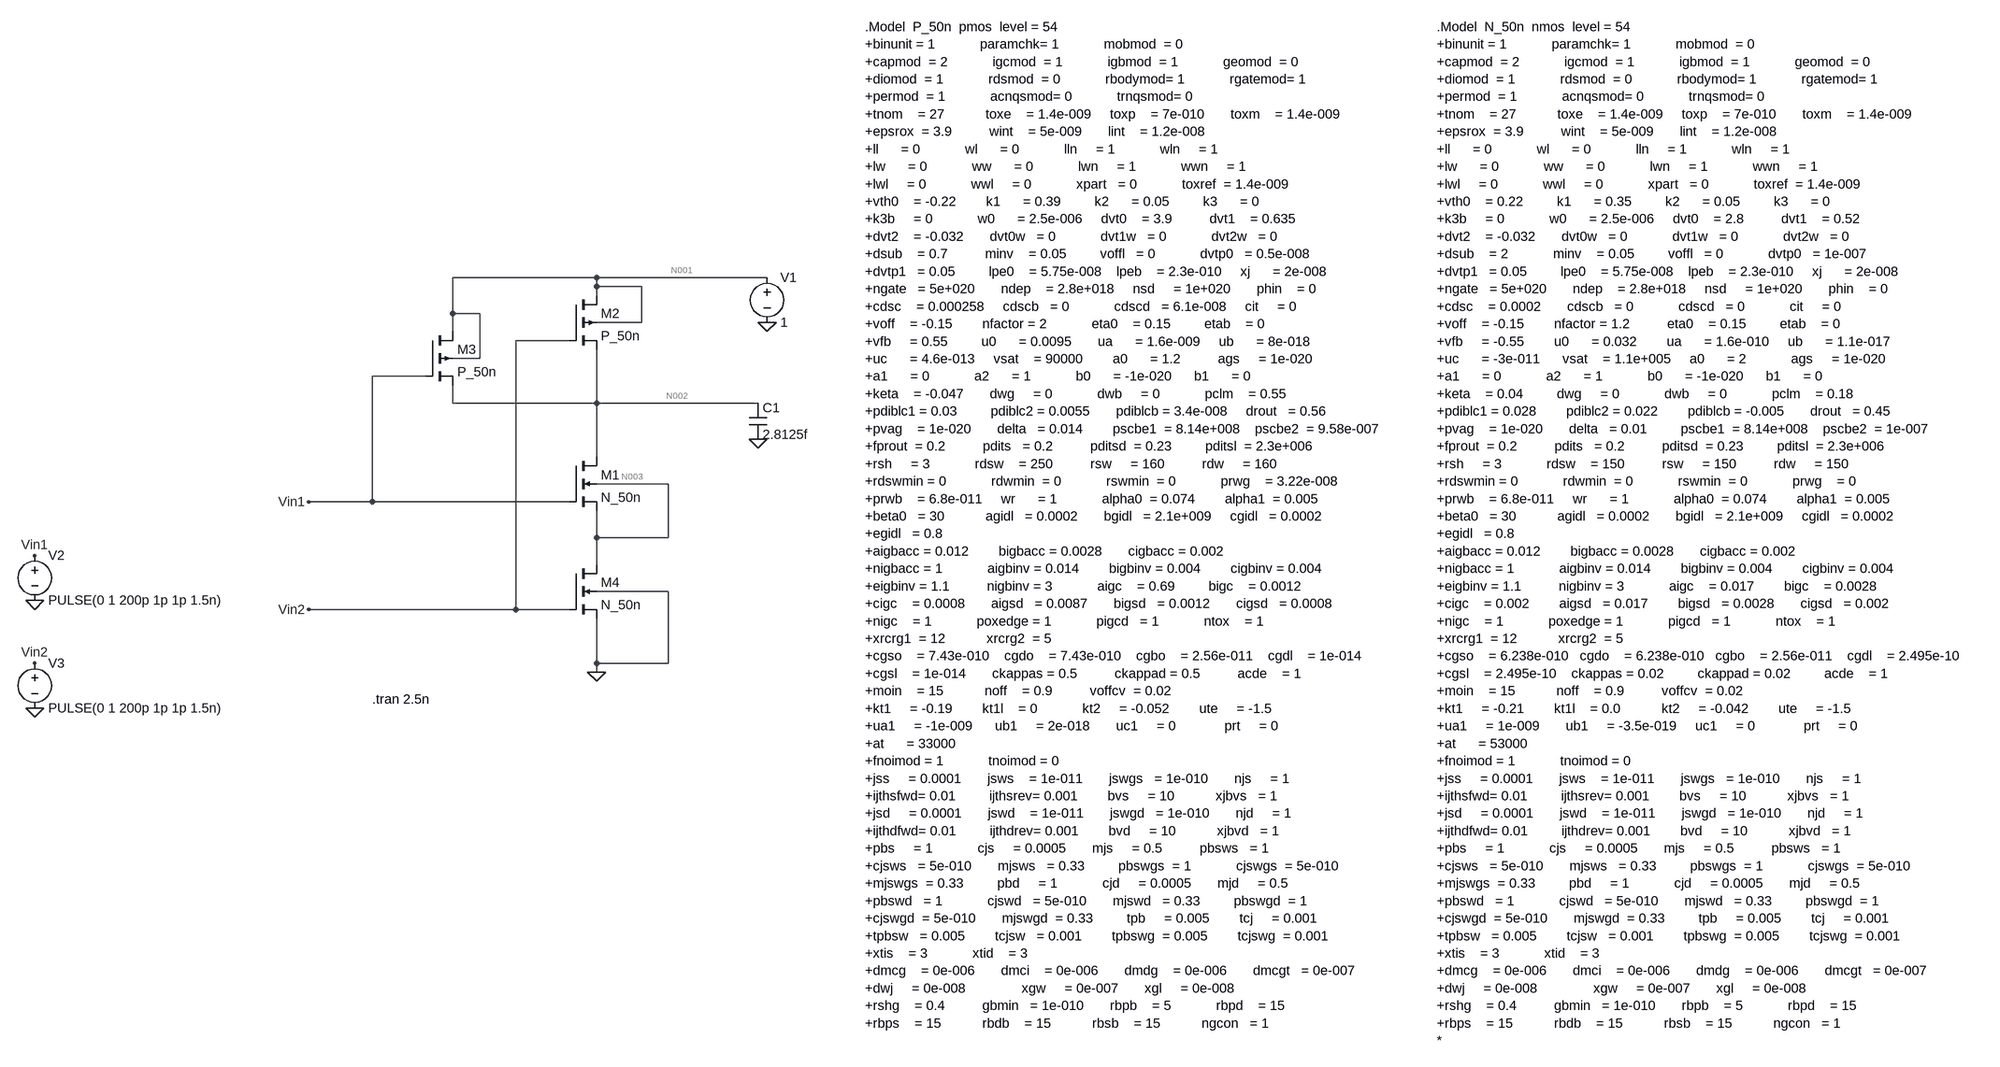
[diagram p0: schematic NAND.asc]
NAND.asc, the LTspice schematic file:
Version 4
SHEET 1 2464 1280
WIRE -1168 64 -1424 64
WIRE -864 64 -1168 64
WIRE -1168 80 -1168 64
WIRE -1088 80 -1168 80
WIRE -1168 96 -1168 80
WIRE -1424 128 -1424 64
WIRE -1376 128 -1424 128
WIRE -1088 144 -1088 80
WIRE -1088 144 -1168 144
WIRE -1424 160 -1424 128
WIRE -1216 176 -1312 176
WIRE -1376 208 -1376 128
WIRE -1376 208 -1424 208
WIRE -1472 240 -1568 240
WIRE -1424 288 -1424 256
WIRE -1168 288 -1168 192
WIRE -1168 288 -1424 288
WIRE -880 288 -1168 288
WIRE -1168 384 -1168 288
WIRE -1040 432 -1168 432
WIRE -1568 464 -1568 240
WIRE -1568 464 -1696 464
WIRE -1216 464 -1568 464
WIRE -1168 528 -1168 480
WIRE -1040 528 -1040 432
WIRE -1040 528 -1168 528
WIRE -1168 576 -1168 528
WIRE -1040 624 -1168 624
WIRE -1312 656 -1312 176
WIRE -1312 656 -1696 656
WIRE -1216 656 -1312 656
WIRE -1168 752 -1168 672
WIRE -1040 752 -1040 624
WIRE -1040 752 -1168 752
WIRE -1168 768 -1168 752
FLAG -1168 768 0
FLAG -864 144 0
FLAG -2256 832 0
FLAG -2256 640 0
FLAG -2256 560 Vin1
FLAG -1696 464 Vin1
FLAG -1696 656 Vin2
FLAG -2256 752 Vin2
FLAG -880 352 0
SYMBOL voltage -864 48 R0
WINDOW 123 0 0 Left 0
WINDOW 39 0 0 Left 0
SYMATTR InstName V1
SYMATTR Value 1
SYMBOL pmos4 -1216 96 R0
SYMATTR InstName M2
SYMATTR Value P_50n
SYMATTR Value2 l=50n w=1000n
SYMBOL pmos4 -1472 160 R0
SYMATTR InstName M3
SYMATTR Value P_50n
SYMATTR Value2 l=50n w=1000n
SYMBOL nmos4 -1216 384 R0
SYMATTR InstName M1
SYMATTR Value N_50n
SYMATTR Value2 l=50n w=1000n
SYMBOL nmos4 -1216 576 R0
SYMATTR InstName M4
SYMATTR Value N_50n
SYMATTR Value2 l=50n w=1000n
SYMBOL voltage -2256 544 R0
WINDOW 123 0 0 Left 0
WINDOW 39 0 0 Left 0
SYMATTR InstName V2
SYMATTR Value PULSE(0 1 200p 1p 1p 1.5n)
SYMBOL voltage -2256 736 R0
WINDOW 123 0 0 Left 0
WINDOW 39 0 0 Left 0
SYMATTR InstName V3
SYMATTR Value PULSE(0 1 200p 1p 1p 1.5n)
SYMBOL cap -896 288 R0
SYMATTR InstName C1
SYMATTR Value 2.8125f
TEXT 184 -384 Left 2 !.Model  P_50n  pmos  level = 54\n+binunit = 1            paramchk= 1            mobmod  = 0          \n+capmod  = 2            igcmod  = 1            igbmod  = 1            geomod  = 0          \n+diomod  = 1            rdsmod  = 0            rbodymod= 1            rgatemod= 1          \n+permod  = 1            acnqsmod= 0            trnqsmod= 0          \n+tnom    = 27           toxe    = 1.4e-009     toxp    = 7e-010       toxm    = 1.4e-009   \n+epsrox  = 3.9          wint    = 5e-009       lint    = 1.2e-008   \n+ll      = 0            wl      = 0            lln     = 1            wln     = 1          \n+lw      = 0            ww      = 0            lwn     = 1            wwn     = 1          \n+lwl     = 0            wwl     = 0            xpart   = 0            toxref  = 1.4e-009   \n+vth0    = -0.22        k1      = 0.39         k2      = 0.05         k3      = 0          \n+k3b     = 0            w0      = 2.5e-006     dvt0    = 3.9          dvt1    = 0.635        \n+dvt2    = -0.032       dvt0w   = 0            dvt1w   = 0            dvt2w   = 0          \n+dsub    = 0.7          minv    = 0.05         voffl   = 0            dvtp0   = 0.5e-008     \n+dvtp1   = 0.05         lpe0    = 5.75e-008    lpeb    = 2.3e-010     xj      = 2e-008     \n+ngate   = 5e+020       ndep    = 2.8e+018     nsd     = 1e+020       phin    = 0          \n+cdsc    = 0.000258     cdscb   = 0            cdscd   = 6.1e-008     cit     = 0          \n+voff    = -0.15        nfactor = 2            eta0    = 0.15         etab    = 0          \n+vfb     = 0.55         u0      = 0.0095       ua      = 1.6e-009     ub      = 8e-018     \n+uc      = 4.6e-013     vsat    = 90000        a0      = 1.2          ags     = 1e-020     \n+a1      = 0            a2      = 1            b0      = -1e-020      b1      = 0          \n+keta    = -0.047       dwg     = 0            dwb     = 0            pclm    = 0.55       \n+pdiblc1 = 0.03         pdiblc2 = 0.0055       pdiblcb = 3.4e-008     drout   = 0.56       \n+pvag    = 1e-020       delta   = 0.014        pscbe1  = 8.14e+008    pscbe2  = 9.58e-007  \n+fprout  = 0.2          pdits   = 0.2          pditsd  = 0.23         pditsl  = 2.3e+006   \n+rsh     = 3            rdsw    = 250          rsw     = 160          rdw     = 160        \n+rdswmin = 0            rdwmin  = 0            rswmin  = 0            prwg    = 3.22e-008  \n+prwb    = 6.8e-011     wr      = 1            alpha0  = 0.074        alpha1  = 0.005      \n+beta0   = 30           agidl   = 0.0002       bgidl   = 2.1e+009     cgidl   = 0.0002     \n+egidl   = 0.8          \n+aigbacc = 0.012        bigbacc = 0.0028       cigbacc = 0.002\n+nigbacc = 1            aigbinv = 0.014        bigbinv = 0.004        cigbinv = 0.004\n+eigbinv = 1.1          nigbinv = 3            aigc    = 0.69         bigc    = 0.0012\n+cigc    = 0.0008       aigsd   = 0.0087       bigsd   = 0.0012       cigsd   = 0.0008\n+nigc    = 1            poxedge = 1            pigcd   = 1            ntox    = 1\n+xrcrg1  = 12           xrcrg2  = 5          \n+cgso    = 7.43e-010    cgdo    = 7.43e-010    cgbo    = 2.56e-011    cgdl    = 1e-014     \n+cgsl    = 1e-014       ckappas = 0.5          ckappad = 0.5          acde    = 1          \n+moin    = 15           noff    = 0.9          voffcv  = 0.02       \n+kt1     = -0.19        kt1l    = 0            kt2     = -0.052        ute     = -1.5\n+ua1     = -1e-009      ub1     = 2e-018       uc1     = 0             prt     = 0\n+at      = 33000\n+fnoimod = 1            tnoimod = 0          \n+jss     = 0.0001       jsws    = 1e-011       jswgs   = 1e-010       njs     = 1          \n+ijthsfwd= 0.01         ijthsrev= 0.001        bvs     = 10           xjbvs   = 1          \n+jsd     = 0.0001       jswd    = 1e-011       jswgd   = 1e-010       njd     = 1          \n+ijthdfwd= 0.01         ijthdrev= 0.001        bvd     = 10           xjbvd   = 1          \n+pbs     = 1            cjs     = 0.0005       mjs     = 0.5          pbsws   = 1          \n+cjsws   = 5e-010       mjsws   = 0.33         pbswgs  = 1            cjswgs  = 5e-010     \n+mjswgs  = 0.33         pbd     = 1            cjd     = 0.0005       mjd     = 0.5        \n+pbswd   = 1            cjswd   = 5e-010       mjswd   = 0.33         pbswgd  = 1          \n+cjswgd  = 5e-010       mjswgd  = 0.33         tpb     = 0.005        tcj     = 0.001      \n+tpbsw   = 0.005        tcjsw   = 0.001        tpbswg  = 0.005        tcjswg  = 0.001      \n+xtis    = 3            xtid    = 3          \n+dmcg    = 0e-006       dmci    = 0e-006       dmdg    = 0e-006       dmcgt   = 0e-007     \n+dwj     = 0e-008               xgw     = 0e-007       xgl     = 0e-008     \n+rshg    = 0.4          gbmin   = 1e-010       rbpb    = 5            rbpd    = 15         \n+rbps    = 15           rbdb    = 15           rbsb    = 15           ngcon   = 1
TEXT 1408 -384 Left 2 !.Model  N_50n  nmos  level = 54\n+binunit = 1            paramchk= 1            mobmod  = 0          \n+capmod  = 2            igcmod  = 1            igbmod  = 1            geomod  = 0          \n+diomod  = 1            rdsmod  = 0            rbodymod= 1            rgatemod= 1          \n+permod  = 1            acnqsmod= 0            trnqsmod= 0          \n+tnom    = 27           toxe    = 1.4e-009     toxp    = 7e-010       toxm    = 1.4e-009   \n+epsrox  = 3.9          wint    = 5e-009       lint    = 1.2e-008   \n+ll      = 0            wl      = 0            lln     = 1            wln     = 1          \n+lw      = 0            ww      = 0            lwn     = 1            wwn     = 1          \n+lwl     = 0            wwl     = 0            xpart   = 0            toxref  = 1.4e-009   \n+vth0    = 0.22         k1      = 0.35         k2      = 0.05         k3      = 0          \n+k3b     = 0            w0      = 2.5e-006     dvt0    = 2.8          dvt1    = 0.52       \n+dvt2    = -0.032       dvt0w   = 0            dvt1w   = 0            dvt2w   = 0          \n+dsub    = 2            minv    = 0.05         voffl   = 0            dvtp0   = 1e-007     \n+dvtp1   = 0.05         lpe0    = 5.75e-008    lpeb    = 2.3e-010     xj      = 2e-008     \n+ngate   = 5e+020       ndep    = 2.8e+018     nsd     = 1e+020       phin    = 0          \n+cdsc    = 0.0002       cdscb   = 0            cdscd   = 0            cit     = 0          \n+voff    = -0.15        nfactor = 1.2          eta0    = 0.15         etab    = 0          \n+vfb     = -0.55        u0      = 0.032        ua      = 1.6e-010     ub      = 1.1e-017   \n+uc      = -3e-011      vsat    = 1.1e+005     a0      = 2            ags     = 1e-020     \n+a1      = 0            a2      = 1            b0      = -1e-020      b1      = 0          \n+keta    = 0.04         dwg     = 0            dwb     = 0            pclm    = 0.18       \n+pdiblc1 = 0.028        pdiblc2 = 0.022        pdiblcb = -0.005       drout   = 0.45       \n+pvag    = 1e-020       delta   = 0.01         pscbe1  = 8.14e+008    pscbe2  = 1e-007     \n+fprout  = 0.2          pdits   = 0.2          pditsd  = 0.23         pditsl  = 2.3e+006   \n+rsh     = 3            rdsw    = 150          rsw     = 150          rdw     = 150        \n+rdswmin = 0            rdwmin  = 0            rswmin  = 0            prwg    = 0          \n+prwb    = 6.8e-011     wr      = 1            alpha0  = 0.074        alpha1  = 0.005      \n+beta0   = 30           agidl   = 0.0002       bgidl   = 2.1e+009     cgidl   = 0.0002     \n+egidl   = 0.8          \n+aigbacc = 0.012        bigbacc = 0.0028       cigbacc = 0.002\n+nigbacc = 1            aigbinv = 0.014        bigbinv = 0.004        cigbinv = 0.004\n+eigbinv = 1.1          nigbinv = 3            aigc    = 0.017        bigc    = 0.0028\n+cigc    = 0.002        aigsd   = 0.017        bigsd   = 0.0028       cigsd   = 0.002\n+nigc    = 1            poxedge = 1            pigcd   = 1            ntox    = 1\n+xrcrg1  = 12           xrcrg2  = 5          \n+cgso    = 6.238e-010   cgdo    = 6.238e-010   cgbo    = 2.56e-011    cgdl    = 2.495e-10     \n+cgsl    = 2.495e-10    ckappas = 0.02         ckappad = 0.02         acde    = 1          \n+moin    = 15           noff    = 0.9          voffcv  = 0.02       \n+kt1     = -0.21        kt1l    = 0.0           kt2     = -0.042        ute     = -1.5\n+ua1     = 1e-009       ub1     = -3.5e-019     uc1     = 0             prt     = 0\n+at      = 53000\n+fnoimod = 1            tnoimod = 0          \n+jss     = 0.0001       jsws    = 1e-011       jswgs   = 1e-010       njs     = 1          \n+ijthsfwd= 0.01         ijthsrev= 0.001        bvs     = 10           xjbvs   = 1          \n+jsd     = 0.0001       jswd    = 1e-011       jswgd   = 1e-010       njd     = 1          \n+ijthdfwd= 0.01         ijthdrev= 0.001        bvd     = 10           xjbvd   = 1          \n+pbs     = 1            cjs     = 0.0005       mjs     = 0.5          pbsws   = 1          \n+cjsws   = 5e-010       mjsws   = 0.33         pbswgs  = 1            cjswgs  = 5e-010     \n+mjswgs  = 0.33         pbd     = 1            cjd     = 0.0005       mjd     = 0.5        \n+pbswd   = 1            cjswd   = 5e-010       mjswd   = 0.33         pbswgd  = 1          \n+cjswgd  = 5e-010       mjswgd  = 0.33         tpb     = 0.005        tcj     = 0.001      \n+tpbsw   = 0.005        tcjsw   = 0.001        tpbswg  = 0.005        tcjswg  = 0.001      \n+xtis    = 3            xtid    = 3          \n+dmcg    = 0e-006       dmci    = 0e-006       dmdg    = 0e-006       dmcgt   = 0e-007     \n+dwj     = 0e-008               xgw     = 0e-007       xgl     = 0e-008     \n+rshg    = 0.4          gbmin   = 1e-010       rbpb    = 5            rbpd    = 15         \n+rbps    = 15           rbdb    = 15           rbsb    = 15           ngcon   = 1\n*
TEXT -1568 816 Left 2 !.tran 2.5n

The netlist it stands for:
* NAND.asc
V1 N001 0 1
M2 N001 Vin2 N002 N001 P_50n l=50n w=1000n
M3 N001 Vin1 N002 N001 P_50n l=50n w=1000n
M1 N002 Vin1 N003 N003 N_50n l=50n w=1000n
M4 N003 Vin2 0 0 N_50n l=50n w=1000n
V2 Vin1 0 PULSE(0 1 200p 1p 1p 1.5n)
V3 Vin2 0 PULSE(0 1 200p 1p 1p 1.5n)
C1 N002 0 2.8125f
.model NMOS NMOS
.model PMOS PMOS
.lib standard.mos
.Model  P_50n  pmos  level = 54
+binunit = 1            paramchk= 1            mobmod  = 0
+capmod  = 2            igcmod  = 1            igbmod  = 1            geomod  = 0
+diomod  = 1            rdsmod  = 0            rbodymod= 1            rgatemod= 1
+permod  = 1            acnqsmod= 0            trnqsmod= 0
+tnom    = 27           toxe    = 1.4e-009     toxp    = 7e-010       toxm    = 1.4e-009
+epsrox  = 3.9          wint    = 5e-009       lint    = 1.2e-008
+ll      = 0            wl      = 0            lln     = 1            wln     = 1
+lw      = 0            ww      = 0            lwn     = 1            wwn     = 1
+lwl     = 0            wwl     = 0            xpart   = 0            toxref  = 1.4e-009
+vth0    = -0.22        k1      = 0.39         k2      = 0.05         k3      = 0
+k3b     = 0            w0      = 2.5e-006     dvt0    = 3.9          dvt1    = 0.635
+dvt2    = -0.032       dvt0w   = 0            dvt1w   = 0            dvt2w   = 0
+dsub    = 0.7          minv    = 0.05         voffl   = 0            dvtp0   = 0.5e-008
+dvtp1   = 0.05         lpe0    = 5.75e-008    lpeb    = 2.3e-010     xj      = 2e-008
+ngate   = 5e+020       ndep    = 2.8e+018     nsd     = 1e+020       phin    = 0
+cdsc    = 0.000258     cdscb   = 0            cdscd   = 6.1e-008     cit     = 0
+voff    = -0.15        nfactor = 2            eta0    = 0.15         etab    = 0
+vfb     = 0.55         u0      = 0.0095       ua      = 1.6e-009     ub      = 8e-018
+uc      = 4.6e-013     vsat    = 90000        a0      = 1.2          ags     = 1e-020
+a1      = 0            a2      = 1            b0      = -1e-020      b1      = 0
+keta    = -0.047       dwg     = 0            dwb     = 0            pclm    = 0.55
+pdiblc1 = 0.03         pdiblc2 = 0.0055       pdiblcb = 3.4e-008     drout   = 0.56
+pvag    = 1e-020       delta   = 0.014        pscbe1  = 8.14e+008    pscbe2  = 9.58e-007
+fprout  = 0.2          pdits   = 0.2          pditsd  = 0.23         pditsl  = 2.3e+006
+rsh     = 3            rdsw    = 250          rsw     = 160          rdw     = 160
+rdswmin = 0            rdwmin  = 0            rswmin  = 0            prwg    = 3.22e-008
+prwb    = 6.8e-011     wr      = 1            alpha0  = 0.074        alpha1  = 0.005
+beta0   = 30           agidl   = 0.0002       bgidl   = 2.1e+009     cgidl   = 0.0002
+egidl   = 0.8
+aigbacc = 0.012        bigbacc = 0.0028       cigbacc = 0.002
+nigbacc = 1            aigbinv = 0.014        bigbinv = 0.004        cigbinv = 0.004
+eigbinv = 1.1          nigbinv = 3            aigc    = 0.69         bigc    = 0.0012
+cigc    = 0.0008       aigsd   = 0.0087       bigsd   = 0.0012       cigsd   = 0.0008
+nigc    = 1            poxedge = 1            pigcd   = 1            ntox    = 1
+xrcrg1  = 12           xrcrg2  = 5
+cgso    = 7.43e-010    cgdo    = 7.43e-010    cgbo    = 2.56e-011    cgdl    = 1e-014
+cgsl    = 1e-014       ckappas = 0.5          ckappad = 0.5          acde    = 1
+moin    = 15           noff    = 0.9          voffcv  = 0.02
+kt1     = -0.19        kt1l    = 0            kt2     = -0.052        ute     = -1.5
+ua1     = -1e-009      ub1     = 2e-018       uc1     = 0             prt     = 0
+at      = 33000
+fnoimod = 1            tnoimod = 0
+jss     = 0.0001       jsws    = 1e-011       jswgs   = 1e-010       njs     = 1
+ijthsfwd= 0.01         ijthsrev= 0.001        bvs     = 10           xjbvs   = 1
+jsd     = 0.0001       jswd    = 1e-011       jswgd   = 1e-010       njd     = 1
+ijthdfwd= 0.01         ijthdrev= 0.001        bvd     = 10           xjbvd   = 1
+pbs     = 1            cjs     = 0.0005       mjs     = 0.5          pbsws   = 1
+cjsws   = 5e-010       mjsws   = 0.33         pbswgs  = 1            cjswgs  = 5e-010
+mjswgs  = 0.33         pbd     = 1            cjd     = 0.0005       mjd     = 0.5
+pbswd   = 1            cjswd   = 5e-010       mjswd   = 0.33         pbswgd  = 1
+cjswgd  = 5e-010       mjswgd  = 0.33         tpb     = 0.005        tcj     = 0.001
+tpbsw   = 0.005        tcjsw   = 0.001        tpbswg  = 0.005        tcjswg  = 0.001
+xtis    = 3            xtid    = 3
+dmcg    = 0e-006       dmci    = 0e-006       dmdg    = 0e-006       dmcgt   = 0e-007
+dwj     = 0e-008               xgw     = 0e-007       xgl     = 0e-008
+rshg    = 0.4          gbmin   = 1e-010       rbpb    = 5            rbpd    = 15
+rbps    = 15           rbdb    = 15           rbsb    = 15           ngcon   = 1
.Model  N_50n  nmos  level = 54
+binunit = 1            paramchk= 1            mobmod  = 0
+capmod  = 2            igcmod  = 1            igbmod  = 1            geomod  = 0
+diomod  = 1            rdsmod  = 0            rbodymod= 1            rgatemod= 1
+permod  = 1            acnqsmod= 0            trnqsmod= 0
+tnom    = 27           toxe    = 1.4e-009     toxp    = 7e-010       toxm    = 1.4e-009
+epsrox  = 3.9          wint    = 5e-009       lint    = 1.2e-008
+ll      = 0            wl      = 0            lln     = 1            wln     = 1
+lw      = 0            ww      = 0            lwn     = 1            wwn     = 1
+lwl     = 0            wwl     = 0            xpart   = 0            toxref  = 1.4e-009
+vth0    = 0.22         k1      = 0.35         k2      = 0.05         k3      = 0
+k3b     = 0            w0      = 2.5e-006     dvt0    = 2.8          dvt1    = 0.52
+dvt2    = -0.032       dvt0w   = 0            dvt1w   = 0            dvt2w   = 0
+dsub    = 2            minv    = 0.05         voffl   = 0            dvtp0   = 1e-007
+dvtp1   = 0.05         lpe0    = 5.75e-008    lpeb    = 2.3e-010     xj      = 2e-008
+ngate   = 5e+020       ndep    = 2.8e+018     nsd     = 1e+020       phin    = 0
+cdsc    = 0.0002       cdscb   = 0            cdscd   = 0            cit     = 0
+voff    = -0.15        nfactor = 1.2          eta0    = 0.15         etab    = 0
+vfb     = -0.55        u0      = 0.032        ua      = 1.6e-010     ub      = 1.1e-017
+uc      = -3e-011      vsat    = 1.1e+005     a0      = 2            ags     = 1e-020
+a1      = 0            a2      = 1            b0      = -1e-020      b1      = 0
+keta    = 0.04         dwg     = 0            dwb     = 0            pclm    = 0.18
+pdiblc1 = 0.028        pdiblc2 = 0.022        pdiblcb = -0.005       drout   = 0.45
+pvag    = 1e-020       delta   = 0.01         pscbe1  = 8.14e+008    pscbe2  = 1e-007
+fprout  = 0.2          pdits   = 0.2          pditsd  = 0.23         pditsl  = 2.3e+006
+rsh     = 3            rdsw    = 150          rsw     = 150          rdw     = 150
+rdswmin = 0            rdwmin  = 0            rswmin  = 0            prwg    = 0
+prwb    = 6.8e-011     wr      = 1            alpha0  = 0.074        alpha1  = 0.005
+beta0   = 30           agidl   = 0.0002       bgidl   = 2.1e+009     cgidl   = 0.0002
+egidl   = 0.8
+aigbacc = 0.012        bigbacc = 0.0028       cigbacc = 0.002
+nigbacc = 1            aigbinv = 0.014        bigbinv = 0.004        cigbinv = 0.004
+eigbinv = 1.1          nigbinv = 3            aigc    = 0.017        bigc    = 0.0028
+cigc    = 0.002        aigsd   = 0.017        bigsd   = 0.0028       cigsd   = 0.002
+nigc    = 1            poxedge = 1            pigcd   = 1            ntox    = 1
+xrcrg1  = 12           xrcrg2  = 5
+cgso    = 6.238e-010   cgdo    = 6.238e-010   cgbo    = 2.56e-011    cgdl    = 2.495e-10
+cgsl    = 2.495e-10    ckappas = 0.02         ckappad = 0.02         acde    = 1
+moin    = 15           noff    = 0.9          voffcv  = 0.02
+kt1     = -0.21        kt1l    = 0.0           kt2     = -0.042        ute     = -1.5
+ua1     = 1e-009       ub1     = -3.5e-019     uc1     = 0             prt     = 0
+at      = 53000
+fnoimod = 1            tnoimod = 0
+jss     = 0.0001       jsws    = 1e-011       jswgs   = 1e-010       njs     = 1
+ijthsfwd= 0.01         ijthsrev= 0.001        bvs     = 10           xjbvs   = 1
+jsd     = 0.0001       jswd    = 1e-011       jswgd   = 1e-010       njd     = 1
+ijthdfwd= 0.01         ijthdrev= 0.001        bvd     = 10           xjbvd   = 1
+pbs     = 1            cjs     = 0.0005       mjs     = 0.5          pbsws   = 1
+cjsws   = 5e-010       mjsws   = 0.33         pbswgs  = 1            cjswgs  = 5e-010
+mjswgs  = 0.33         pbd     = 1            cjd     = 0.0005       mjd     = 0.5
+pbswd   = 1            cjswd   = 5e-010       mjswd   = 0.33         pbswgd  = 1
+cjswgd  = 5e-010       mjswgd  = 0.33         tpb     = 0.005        tcj     = 0.001
+tpbsw   = 0.005        tcjsw   = 0.001        tpbswg  = 0.005        tcjswg  = 0.001
+xtis    = 3            xtid    = 3
+dmcg    = 0e-006       dmci    = 0e-006       dmdg    = 0e-006       dmcgt   = 0e-007
+dwj     = 0e-008               xgw     = 0e-007       xgl     = 0e-008
+rshg    = 0.4          gbmin   = 1e-010       rbpb    = 5            rbpd    = 15
+rbps    = 15           rbdb    = 15           rbsb    = 15           ngcon   = 1
*
.tran 2.5n
.backanno
.end

* Results of the author's LTspice run, read from the files saved beside the schematic
* Operating Point, zero values left out:
*   V(n001) = 1 V
*   V(n002) = 1 V
*   V(n003) = 41.23 mV
*   Id(M4) = 1.692 nA
*   Is(M4) = -1.691 nA
*   Id(M1) = 2.946 nA
*   Ig(M1) = -1.255 nA
*   Is(M1) = -1.691 nA
*   Id(M3) = 18.9 nA
*   Ig(M3) = -17.57 nA
*   Ib(M3) = 139.3 pA
*   Is(M3) = -1.473 nA
*   Id(M2) = 18.9 nA
*   Ig(M2) = -17.57 nA
*   Ib(M2) = 139.3 pA
*   Is(M2) = -1.473 nA
*   I(V3) = 17.57 nA
*   I(V2) = 18.82 nA
*   I(V1) = -38.08 nA
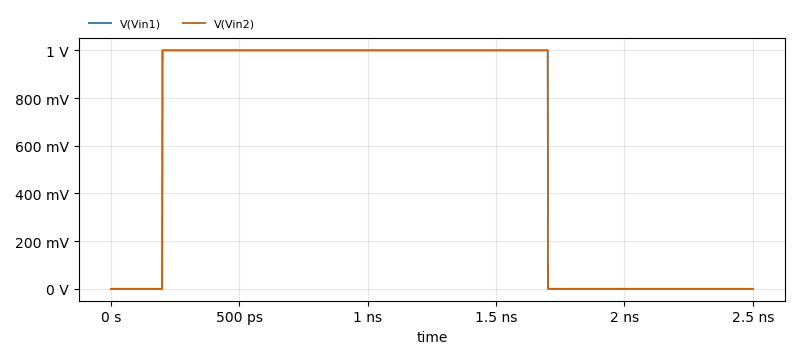
[diagram p1: Transient Analysis of NAND.asc, plotted from the saved traces]
* Transient Analysis, 1 run:
*   V(Vin1): min 0 V, max 1 V, average 600.4 mV, rms 774.8 mV, last 0 V
*   V(Vin2): min 0 V, max 1 V, average 600.4 mV, rms 774.8 mV, last 0 V